# EAGLE design higs_bc_eee (EAGLE 9.6.2)
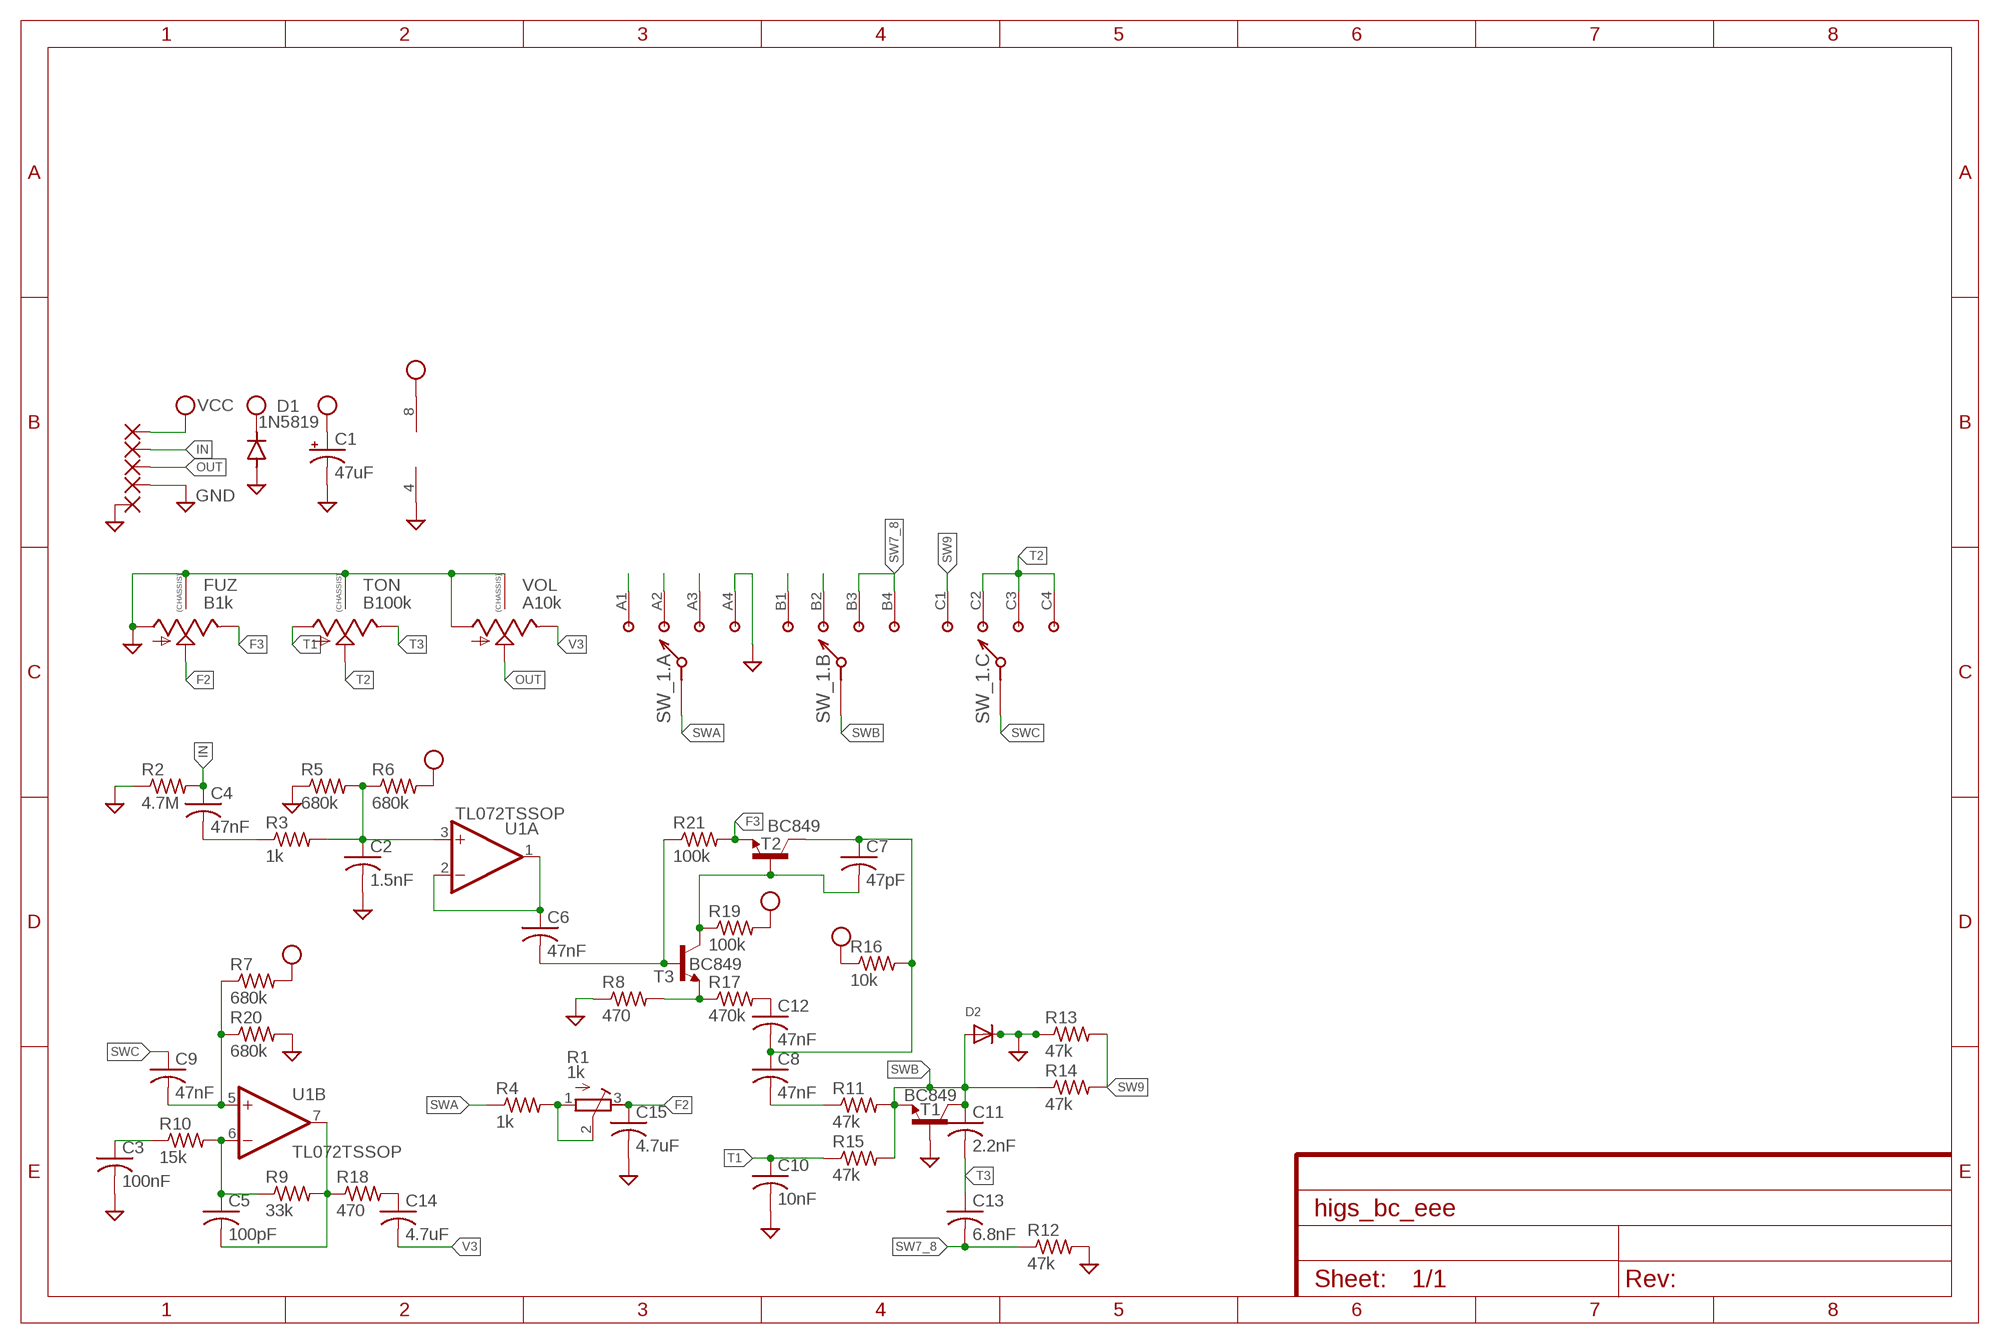
[diagram p0: schematic, sheet 1]

## Parts
C1  47uF  100UF-POLAR-RADIAL-2.5MM-25V-20%  [CPOL-RADIAL-2.5MM-6.5MM]
C2  1.5nF  C-USC0603  [C0603]
C3  100nF  C-USC0603  [C0603]
C4  47nF  C-USC0603  [C0603]
C5  100pF  C-USC0603  [C0603]
C6  47nF  C-USC0603  [C0603]
C7  47pF  C-USC0603  [C0603]
C8  47nF  C-USC0603  [C0603]
C9  47nF  C-USC0603  [C0603]
C10  10nF  C-USC0603  [C0603]
C11  2.2nF  C-USC0603  [C0603]
C12  47nF  C-USC0603  [C0603]
C13  6.8nF  C-USC0603  [C0603]
C14  4.7uF  C-USC1206  [C1206]
C15  4.7uF  C-USC1206  [C1206]
D1  1N5819  DIODE-SOD123  [SOD123]
D2  DIODESOD-123  [SOD-123]
FUZ  B1k  9MM_SNAP-IN_POT_CHASSIS  [9MM_SNAP-IN_POT]
PAD1  1,6/0,8  [1,6/0,8]
PAD2  1,6/0,8  [1,6/0,8]
PAD3  1,6/0,8  [1,6/0,8]
PAD4  1,6/0,8  [1,6/0,8]
PAD5  1,6/0,8  [1,6/0,8]
R1  1k  R-TRIMM3224W  [RTRIM3224W]
R2  4.7M  R-US_R0603  [R0603]
R3  1k  R-US_R0603  [R0603]
R4  1k  R-US_R0603  [R0603]
R5  680k  R-US_R0603  [R0603]
R6  680k  R-US_R0603  [R0603]
R7  680k  R-US_R0603  [R0603]
R8  470  R-US_R0603  [R0603]
R9  33k  R-US_R0603  [R0603]
R10  15k  R-US_R0603  [R0603]
R11  47k  R-US_R0603  [R0603]
R12  47k  R-US_R0603  [R0603]
R13  47k  R-US_R0603  [R0603]
R14  47k  R-US_R0603  [R0603]
R15  47k  R-US_R0603  [R0603]
R16  10k  R-US_R0603  [R0603]
R17  470k  R-US_R0603  [R0603]
R18  470  R-US_R0603  [R0603]
R19  100k  R-US_R0603  [R0603]
R20  680k  R-US_R0603  [R0603]
R21  100k  R-US_R0603  [R0603]
SW_1  3P4T  [3P4T]
T1  BC849  BC849-NPN-SOT23-BEC  [SOT23-BEC]
T2  BC849  BC849-NPN-SOT23-BEC  [SOT23-BEC]
T3  BC849  BC849-NPN-SOT23-BEC  [SOT23-BEC]
TON  B100k  9MM_SNAP-IN_POT_CHASSIS  [9MM_SNAP-IN_POT]
U1  TL072TSSOP  [TSSOP-8]
VOL  A10k  9MM_SNAP-IN_POT_CHASSIS  [9MM_SNAP-IN_POT]

## Nets
F2: C15.1 FUZ.2(S) R1.3(E)
F3: FUZ.3(E) R21.2 T2.E
GND: C1.2(-) C2.2 C3.2 C10.2 C15.2 D1.A D2.C FUZ.1(A) FUZ.CHASSIS1 FUZ.CHASSIS2 PAD4.1(P) PAD5.1(P) R2.1 R5.1 R8.1 R12.2 R13.1 R20.2 SW_1.A4 T1.B TON.CHASSIS1 TON.CHASSIS2 U1.4(P:V-) VOL.1(A) VOL.CHASSIS1 VOL.CHASSIS2
IN: C4.1 PAD2.1(P) R2.2
N$1: C4.2 R3.1
N$2: C2.1 R3.2 R5.2 R6.1 U1.3(A:+IN)
N$3: C6.1 U1.1(A:OUT) U1.2(A:-IN)
N$4: C7.1 C8.1 C12.2 R16.2 T2.C
N$5: C6.2 R21.1 T3.B
N$6: C7.2 R19.1 T2.B T3.C
N$7: R8.2 R17.1 T3.E
N$8: C12.1 R17.2
N$9: C8.2 R11.1
N$10: C9.2 R7.1 R20.1 U1.5(B:+IN)
N$11: R1.1(A) R1.2(S) R4.2
N$12: C5.1 R9.1 R10.2 U1.6(B:-IN)
N$13: C5.2 R9.2 R18.1 U1.7(B:OUT)
N$14: C3.1 R10.1
N$15: C14.1 R18.2
N$16: SW_1.A1
N$17: SW_1.A2
N$18: SW_1.A3
N$20: SW_1.B1
N$21: SW_1.B2
OUT: PAD3.1(P) VOL.2(S)
SW7_8: C13.2 R12.1 SW_1.B3 SW_1.B4
SW9: R13.2 R14.2 SW_1.C1
SWA: R4.1 SW_1.A(.A:A)
SWB: C11.1 D2.A R11.2 R14.1 R15.2 SW_1.B(.B:A) T1.C T1.E
SWC: C9.1 SW_1.C(.C:A)
T1: C10.1 R15.1 TON.1(A)
T2: SW_1.C2 SW_1.C3 SW_1.C4 TON.2(S)
T3: C11.2 C13.1 TON.3(E)
V3: C14.2 VOL.3(E)
VCC: C1.1(+) D1.C PAD1.1(P) R6.2 R7.2 R16.1 R19.2 U1.8(P:V+)

## Library data of the parts
C1 = SparkFun-Capacitors:100UF-POLAR: 100µF polarized capacitors A capacitor is a passive two-terminal electrical component used to store electrical energy temporarily in an electric field.; PROD_ID: CAP-08439; VALUE: 100uF
C2-C15 = adafruit:C-US: CAPACITOR, American symbol
D1 = diode:DIODE-: DIODE
D2 = adafruit:DIODE: Diode SMADIODE - SMA Surface Mount Package 20V 1A Schottky Diode Digikey: 641-1014-6-ND DO-1N4148 - Through Hole Small Current Diode SOD-123 20V 1 A (.5mV Vf) Schottky Diode - Digikey: MBRX120TPMSCT-ND SOD-323 10V 570mA (.38mV Vf, 3ns) Schottky Diode - Digikey: ZLLS410CT-ND SOD-523 30V 30mA Schottky Diode (RB751S-40TE61) - Digikey: RB751S-40TE61CT-ND SOT23-R/W - SOT23 Package (R = Solder Paste/Reflow Ovens, W = Hand-Soldering) BAT54Film 40V 300mA - Digikey: 497-7162-1-ND
FUZ TON VOL = MusicThingModular:9MM_SNAP-IN_POT_CHASSIS: 9mm vertical snap-in pot, Alpha / Panasonic style, with a connection to the metal chassis for grounding
PAD1-PAD5 = wirepad:1,6/0,8: THROUGH-HOLE PAD
R1 = rcl:R-TRIMM: Trimm resistor; SPICEMODEL: X; SPICEPREFIXL: POT
R2-R21 = adafruit:R-US_: RESISTOR, American symbol
SW_1 = switches:3P4T: 3P-4T Rotary
T1-T3 = MusicThingModular:*-NPN-: NPN Transistror BF959 corrected 2008.03.06
U1 = MusicThingModular:TL072: Generic Dual Op Amp

## Board
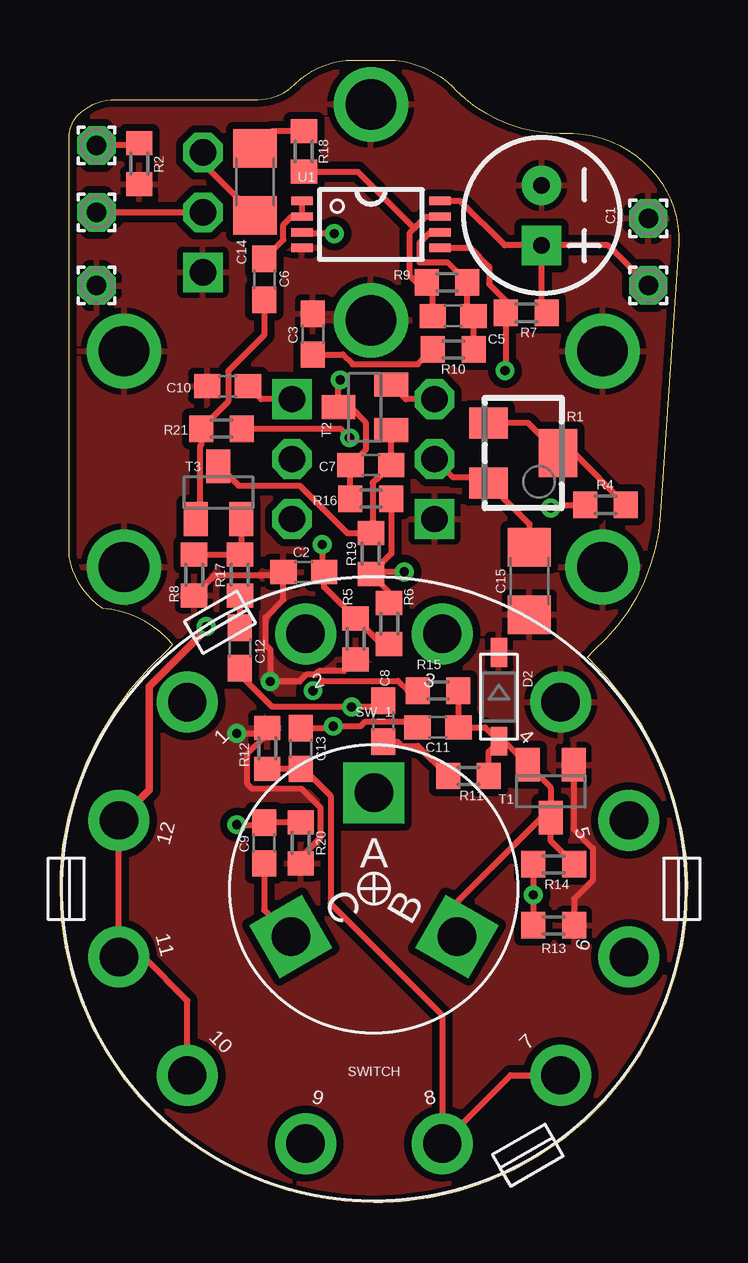
[diagram p1: board, top side]
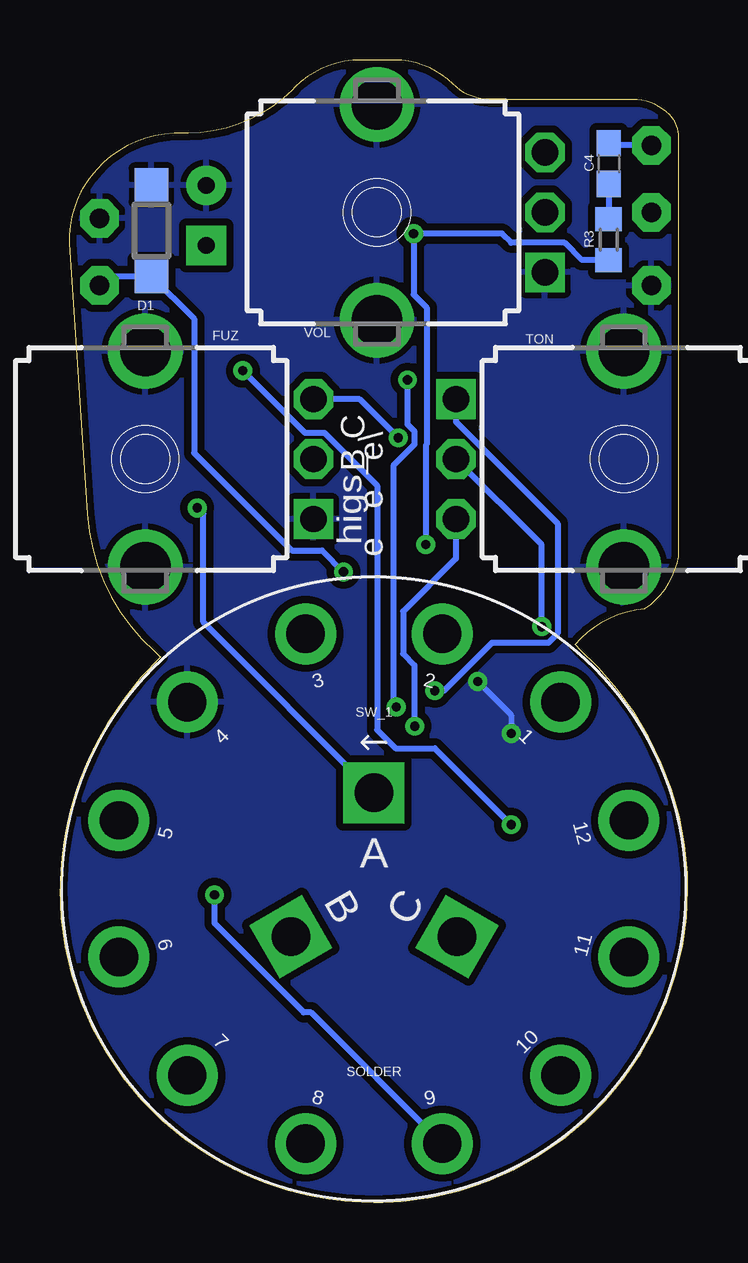
[diagram p2: board, bottom side, seen from below]

Size 26.16 x 47.62 mm. Coordinates in mm from the lower left corner, seen from the top.
Outline: 13.08,0 arc-90 0,13.08 0,13.71 arc-45 4.57,23.11 arc45 4.57,23.14 4.7,23.26 arc45 1.78,24.77 1.79,24.76 arc-45 0.38,26.92 0.38,44.42 arc-45 0.76,45.34 arc-45 2.29,45.97 8.25,45.97 arc45 9.78,46.61 arc-45 12.23,47.62 13.62,47.62 arc-45 16.38,46.48 16.49,46.37 arc45 20.83,44.58 21.39,44.58 arc-45 24.64,43.05 arc-45 25.78,39.97 25.02,28.7 arc-45 22.23,22.99 21.99,22.75 arc45 21.97,22.73 arc-45 26.16,13.2 26.16,13.08 arc-90 13.08,0
Copper layers (1*16): Top 0.035mm / dielectric 1.5mm / Bottom 0.035mm
Design rules "default *": minimum track width 6mil, minimum drill 0.35mm, track to track 6mil, track to pad 6mil, pad to pad 6mil, via to via 6mil, smd to smd 6mil, copper to edge 10mil, drill to drill 6mil, minimum pad ring 10mil, minimum via ring 8mil, stop-mask expansion 4mil, vias tented up to drill 0mil, thermal gap 10mil

### Footprints (pad centres in the part's own frame; a part is rotated, then mirrored left to right if it is on the bottom)
CPOL-RADIAL-2.5MM-6.5MM = drill 0.7 pad 1.651 square: 1 1.25,0 | drill 0.7 pad 1.651: 2 -1.25,0
C0603 = smd 1.1 x 1: 1 -0.85,0; 2 0.85,0
C1206 = smd 1.6 x 1.8: 1 -1.4,0; 2 1.4,0
SOD123 = smd 1.4 x 1.4: A 1.9,0; C -1.9,0
SOD-123 = smd 1.2 x 0.7: A 1.85,0; C -1.85,0
9MM_SNAP-IN_POT = drill 1.1 square: 1 -2.5,-7 | drill 1.1 octagon: 2 0,-7; 3 2.5,-7 | drill 2.1 pad 2.794: CHASSIS1 -4.5,0; CHASSIS2 4.5,0
1,6/0,8 = drill 0.813 pad 1.6 octagon: 1 0,0
RTRIM3224W = smd 1.3 x 1.6: 1 -1.25,-1.45; 3 1.25,-1.45 | smd 2 x 1.6: 2 0,1.45
R0603 = smd 1 x 1.1: 1 -0.85,0; 2 0.85,0
3P4T = drill 1.6 pad 2.54 square: A 0,4; B -3.464,-2; C 3.464,-2 | drill 1.6 pad 2.54: A1 7.778,7.778; A2 2.847,10.625; A3 -2.847,10.625; A4 -7.778,7.778; B1 -10.625,2.847; B2 -10.625,-2.847; B3 -7.778,-7.778; B4 -2.847,-10.625; C1 2.847,-10.625; C2 7.778,-7.778; C3 10.625,-2.847; C4 10.625,2.847
SOT23-BEC = smd 1 x 1.4: B -0.95,-1.1; C 0,1.1; E 0.95,-1.1
TSSOP-8 = smd 0.9 x 0.35: 1 -2.875,0.975; 2 -2.875,0.325; 3 -2.875,-0.325; 4 -2.875,-0.975; 5 2.875,-0.975; 6 2.875,-0.325; 7 2.875,0.325; 8 2.875,0.975

### Placement (x,y rotation side)
C1  20.07,41.15 270 top
C2  10.16,26.29 180 top
C3  10.54,36.2 90 top
C4  3.3,43.31 270 bottom
C5  16.38,36.96 180 top
C6  8.51,38.48 270 top
C7  12.95,30.73 0 top
C8  13.46,20.07 270 top
C9  8.51,14.99 90 top
C10  6.99,34.04 180 top
C11  15.75,19.81 180 top
C12  7.49,23.11 270 top
C13  10.03,18.92 270 top
C14  8.13,42.55 270 top
C15  19.56,25.91 270 top
D1  22.35,40.51 90 bottom
D2  18.29,21.08 270 top
FUZ  22.61,30.99 90 bottom
PAD1  24.51,38.23 0 top
PAD2  1.52,44.07 0 top
PAD3  1.52,41.27 0 top
PAD4  1.52,38.23 0 top
PAD5  24.51,41.02 0 top
R1  19.3,31.24 270 top
R2  3.3,43.31 90 top
R3  3.3,40.13 270 bottom
R4  22.73,29.08 0 top
R5  12.32,23.5 90 top
R6  13.72,24.13 90 top
R7  19.43,37.08 0 top
R8  5.59,26.16 90 top
R9  16.13,38.35 180 top
R10  16.38,35.56 0 top
R11  17.02,17.78 0 top
R12  8.64,18.92 90 top
R13  20.57,11.56 180 top
R14  20.57,14.1 180 top
R15  15.75,21.34 0 top
R16  12.95,29.34 180 top
R17  7.49,26.16 270 top
R18  10.16,43.81 90 top
R19  12.95,27.05 270 top
R20  10.03,14.99 270 top
R21  6.73,32.26 0 top
SW_1  13.08,13.08 0 bottom
T1  20.45,17.14 180 top
T2  12.7,33.15 90 top
T3  6.6,29.59 0 top
TON  2.67,30.99 270 bottom
U1  12.95,40.77 0 top
VOL  12.95,41.27 90 bottom

### Tracks (layer width: path | path; a pad name or v marks a point on that pad's centre or on a via)
F2
  Top 0.254: C15.1 19.56,28.29 R1.3 17.62,30.23 16.37,30.23 FUZ.2
F3  (via drill 0.38)
  Top 0.254: FUZ.3 14.41,33.49 T2.E | R21.2 11.68,32.26 v12.06,31.88
  Bottom 0.254: v12.06,31.88 13.68,33.49 FUZ.3
GND  (via drill 0.38)
  Top 0.254: R20.2 10.03,14.39 10.86,15.22 10.86,16.45 10.07,17.24 8.02,17.24 7.81,17.46 7.81,18.69 8.64,19.52 R12.2 8.42,19.56 v7.37,19.56 | 9.31,26.16 9.31,25.13 8.57,24.39 8.57,23.24 8.76,23.05 v8.76,21.72 9.97,21.72 10.26,22.01 10.64,22.01 10.78,22.15 11.83,22.15 R5.1 | 9.31,26.16 C2.2 | R8.1 6.44,26.16 9.31,26.16 | T1.B 21.4,15.57 22.2,14.76 22.2,13.43 21.42,12.65 R13.1
  Bottom 0.254: v8.76,21.72 7.37,20.32 v7.37,19.56
  pour Top (isolate 0.305): -2.16,-0.89 28.32,-0.89 28.32,48.64 -2.16,48.64
  pour Bottom (isolate 0.305): -2.16,-0.89 28.32,-0.89 28.32,48.64 -2.16,48.64
IN
  Top 0.254: C4.1 3.21,44.07 PAD2.1
  Bottom 0.254: PAD2.1 3.21,44.07 C4.1
N$1
  Bottom 0.254: C4.2 R3.1
N$2  (via drill 0.38)
  Top 0.254: R6.1 13.38,23.28 R5.2 11.01,25.65 C2.1 10.92,26.38 v10.92,27.43 | v11.43,40.39 10.13,40.39 U1.3
  Bottom 0.254: R3.2 4.42,39.28 5.14,40.01 7.37,40.01 7.75,40.39 v11.43,40.39 11.43,37.85 10.88,37.3 10.88,31.6 10.92,31.56 v10.92,27.43
N$3
  Top 0.254: U1.1 U1.2 9.63,41.09 9.31,40.77 9.31,40.13 C6.1
N$4  (via drill 0.38)
  Top 0.254: R16.2 C7.1 12.74,31.37 12.74,32.52 12.11,33.15 T2.C 11.6,34.21 v11.68,34.29 | C12.2 7.49,22.01 8.84,20.66 v12.15,20.66 13.21,20.66 C8.1
  Bottom 0.254: v11.68,34.29 11.68,32.45 11.39,32.16 11.39,31.6 12.27,30.72 12.27,20.79 v12.15,20.66
N$5
  Top 0.254: T3.B 5.83,28.66 5.83,31.51 5.88,31.56 R21.1 7.01,33.38 7.01,34.65 8.51,36.16 C6.2
N$6
  Top 0.254: T2.B C7.2 13.24,30.17 13.19,30.17 13.03,30 13.03,27.97 R19.1 11.98,27.9 9.99,29.88 7.45,29.88 6.64,30.69 T3.C
N$7
  Top 0.254: R8.2 R17.1 7.55,27.07 T3.E
N$8
  Top 0.254: R17.2 C12.1
N$9
  Top 0.254: R11.1 14.92,19.03 14.23,19.03 14.05,19.22 C8.2
N$10  (via drill 0.38)
  Top 0.254: U1.5 17.11,39.79 17.89,39.02 17.89,38.29 18.58,37.59 R7.1 18.58,34.71 v18.54,34.67 | R20.1 8.64,15.84 | 8.64,15.84 C9.2 | v7.37,15.75 8.55,15.75 8.64,15.84
  Bottom 0.254: v18.54,34.67 15.96,32.09 15.15,32.09 12.95,29.89 12.95,19.7 12.17,18.93 10.55,18.93 v7.37,15.75
N$11
  Top 0.254: R1.1 19.5,32.49 R1.2 21.42,31.24 R4.2
N$12
  Top 0.254: U1.6 15.42,40.44 14.99,40.01 14.99,39.18 16.15,39.18 R9.1 16.98,37.21 C5.1 R10.2
N$13
  Top 0.254: U1.7 15.24,41.09 14.76,40.61 | 14.76,40.61 14.58,40.43 14.58,38.63 14.86,38.35 R9.2 15.53,38.1 C5.2 | R18.1 12.41,42.97 14.76,40.61
N$14
  Top 0.254: C3.1 11.79,35.34 12.19,34.94 14.91,34.94 R10.1
N$15
  Top 0.254: R18.2 8.85,44.66 C14.1
OUT
  Top 0.254: PAD3.1 VOL.2
SW7_8
  Top 0.254: R12.1 C13.2 10.16,18.07 11.28,16.96 11.28,12.46 15.93,7.8 SW_1.B4 18.77,5.3 SW_1.B3
SW9  (via drill 0.38)
  Top 0.254: R14.2 v19.72,12.83 R13.2
  Bottom 0.254: SW_1.C1 15.7,7.92 16.01,7.92 19.72,11.64 v19.72,12.83
SWA  (via drill 0.38)
  Top 0.254: v20.45,28.96 20.57,29.08 R4.1
  Bottom 0.254: SW_1.A 20.19,24.19 20.19,28.7 v20.45,28.96
SWB
  Top 0.254: D2.A 17.71,19.81 C11.1 R15.2 | D2.A 18.51,19.23 T1.E 20.45,17.3 T1.C | SW_1.B 16.55,12.52 20.07,16.04 T1.C | R14.1 20.45,15.07 T1.C | R11.2 17.87,18.81 D2.A
SWC
  Top 0.254: SW_1.C 8.51,12.19 C9.1
T1  (via drill 0.38)
  Top 0.254: TON.1 8.38,33.49 C10.1 | R15.1 14.49,21.34 14.08,21.75 10.95,21.75 v10.54,21.34
  Bottom 0.254: TON.1 9.67,32.55 5.42,28.31 5.42,23.72 5.82,23.33 8.16,23.33 10.16,21.34 v10.54,21.34
T2  (via drill 0.38)
  Top 0.254: SW_1.C2 5.3,8.41 3.48,10.23 SW_1.C3 SW_1.C4 | SW_1.C4
  Top 0.305: v6.1,24 6.1,23.88 3.73,21.51 3.73,17.2 SW_1.C4
  Bottom 0.254: v6.1,24 6.1,27.42 TON.2
T3  (via drill 0.38)
  Top 0.254: C13.1 11.3,19.77 v11.39,19.86 12.53,19.86 12.72,20.05 14.67,20.05 C11.2
  Bottom 0.254: TON.3 9.67,26.84 11.87,24.64 11.87,22.88 11.39,22.4 v11.39,19.86
V3
  Top 0.254: VOL.3 5.95,43.32 C14.2
VCC  (via drill 0.38)
  Top 0.254: R16.1 13.8,27.05 13.06,26.31 | 13.06,26.31 R19.2 13.72,25.44 R6.2 | C1.1 18.52,39.9 16.68,41.74 U1.8 | R7.2 20.07,37.3 C1.1 | PAD1.1 22.84,39.9 C1.1 | v14.35,26.29 13.08,26.29 13.06,26.31
  Bottom 0.254: PAD1.1 24.12,38.61 D1.C 20.57,36.84 20.57,31.25 16.51,27.18 15.25,27.18 v14.35,26.29

### Text on the board
bPlace: higs_ | B C | e e e\